# Altium schematic sheet AIRZAI_BASE_BD_REVC Sheet2.SchDoc
size C
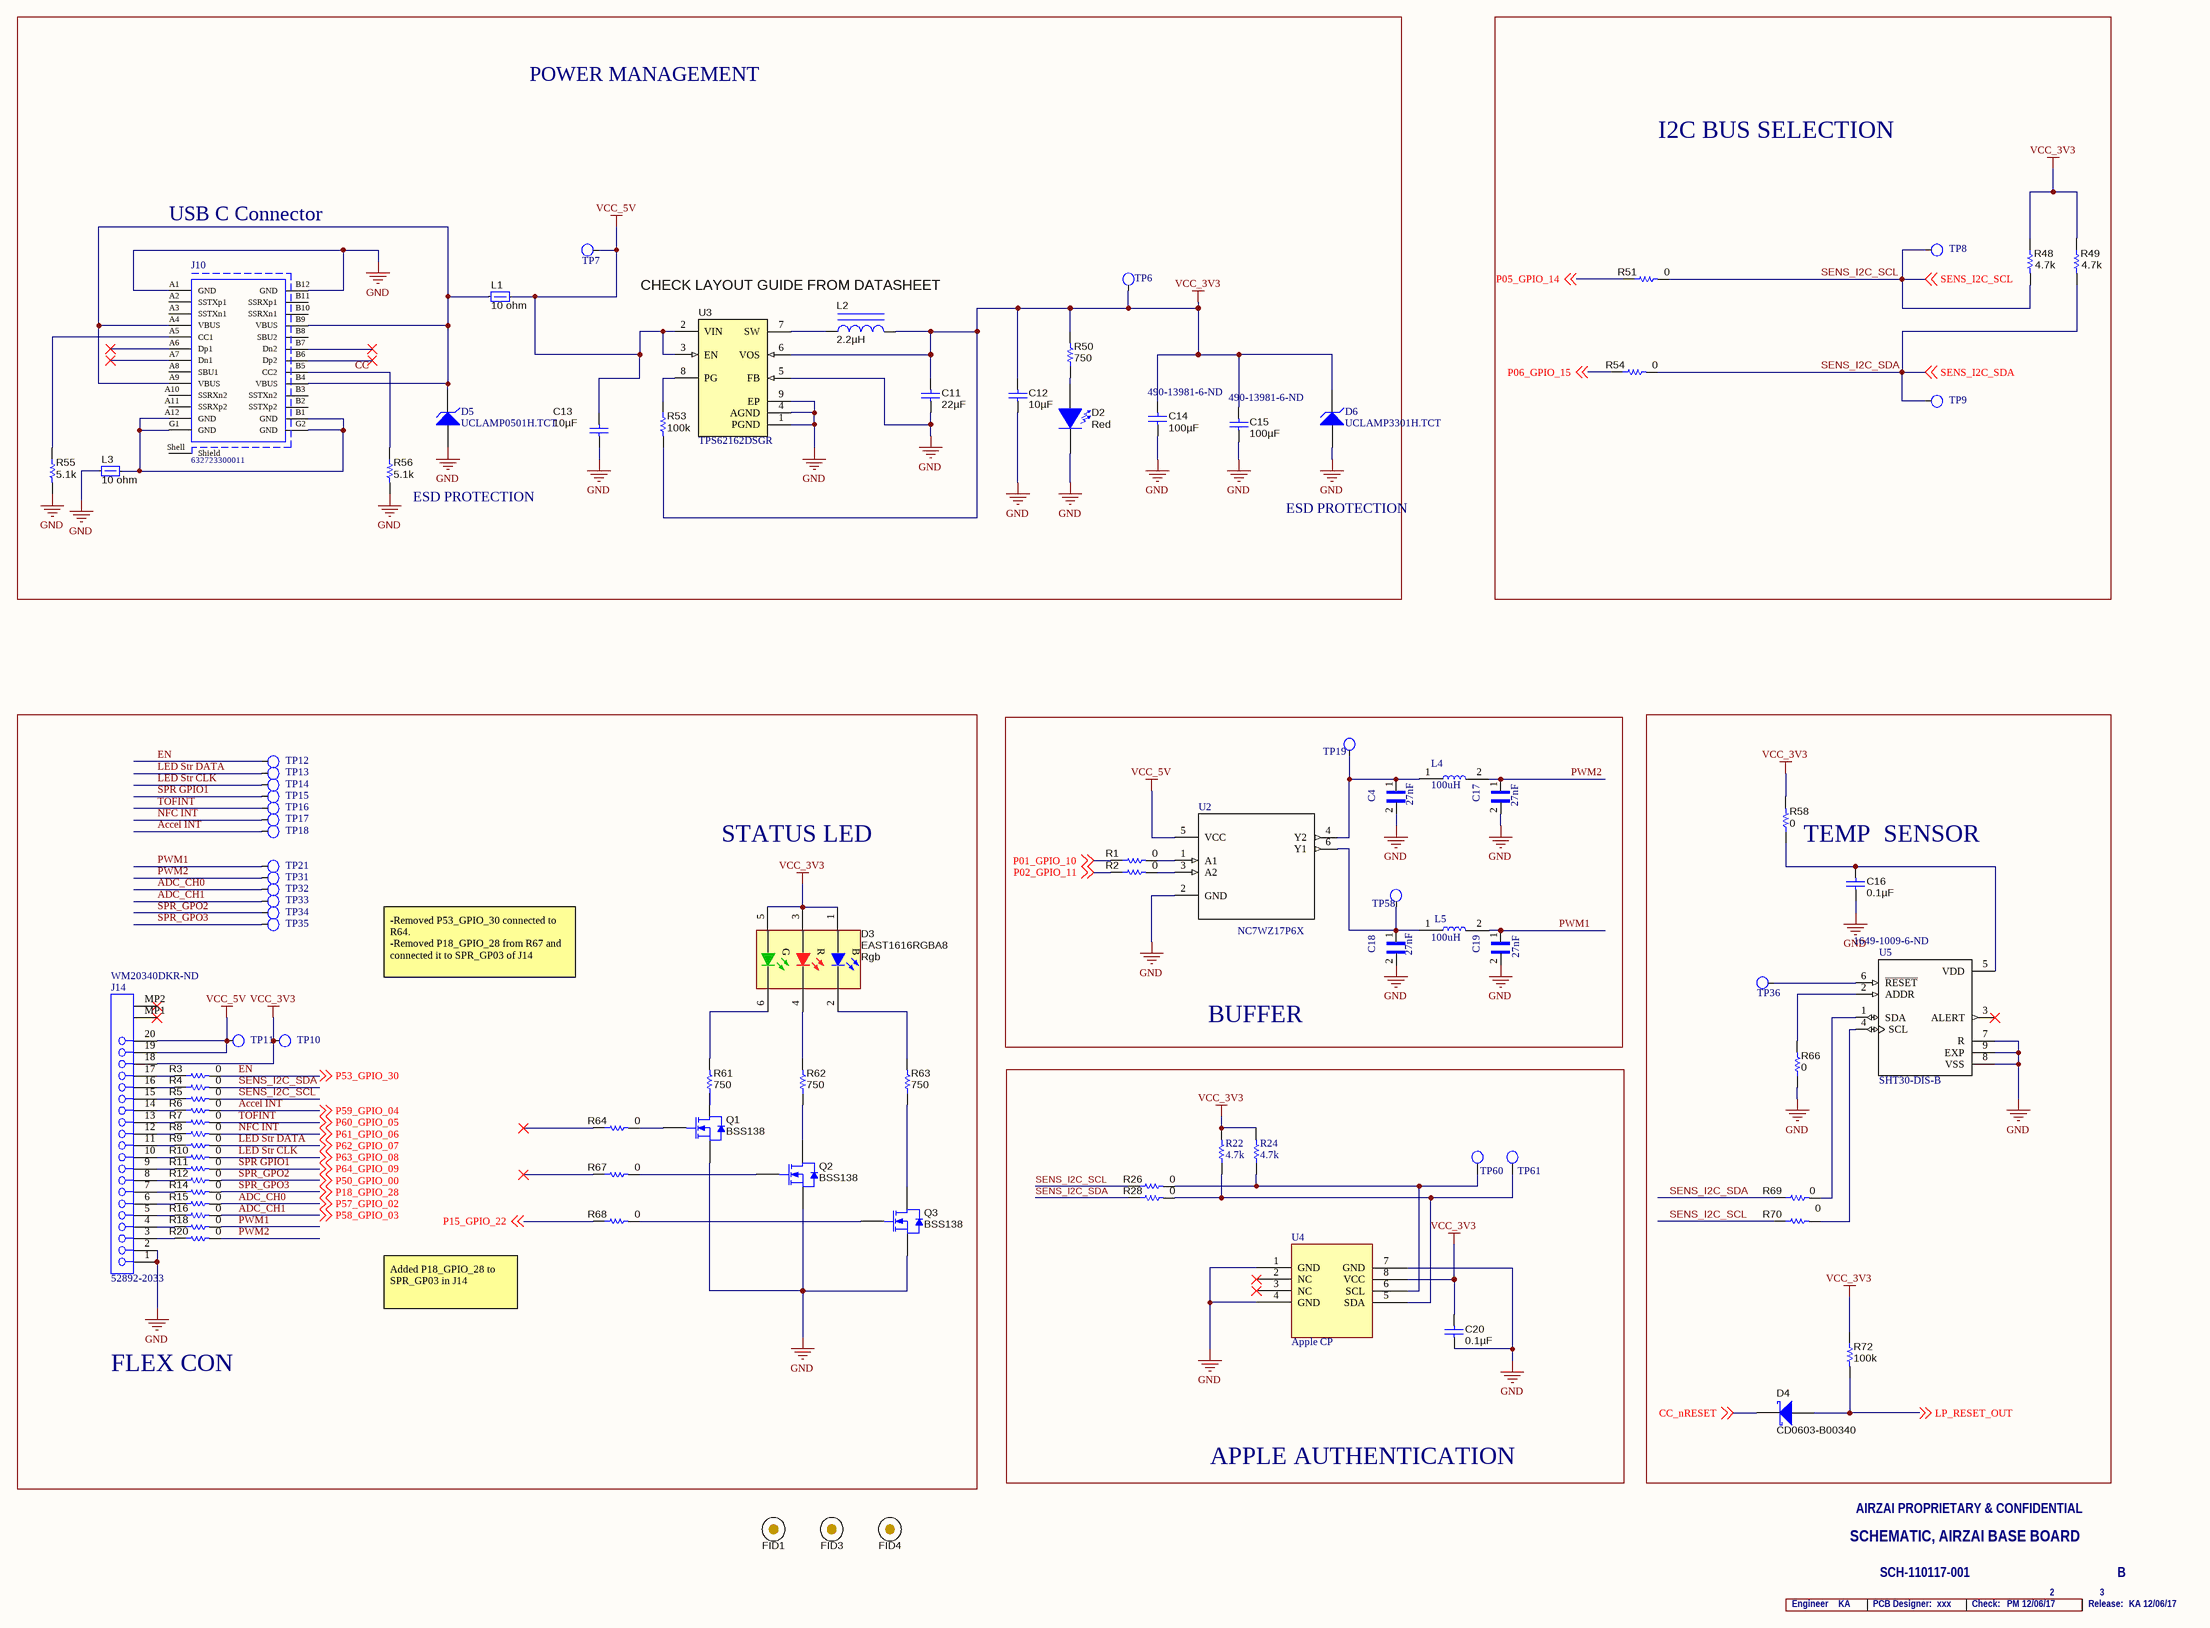
[diagram p0: AIRZAI_BASE_BD_REVC Sheet2.SchDoc]

## Parts
C4  value 27nF  [1206CAP]  (hidden comment: GRM3195C1H273JA01D)
C11  ValueDisplayed: 22µF  [0805_HV]  (hidden comment: C2012X5R1C226K125AC)
C12  ValueDisplayed: 10µF  [0805_HV]  (hidden comment: GRM21BR61A106KE19L)
C13  ValueDisplayed: 10µF  [0805_HV]  (hidden comment: GRM21BR61A106KE19L)
C14  ValueDisplayed: 100µF  Supplier Part Number 3: 490-13981-6-ND  [1206_180]  (hidden comment: GRM31CR60J107ME39L)
C15  ValueDisplayed: 100µF  Supplier Part Number 3: 490-13981-6-ND  [1206_180]  (hidden comment: GRM31CR60J107ME39L)
C16  ValueDisplayed: 0.1µF  [0402]  (hidden comment: GRM155R61A104KA01D)
C17  value 27nF  [1206CAP]  (hidden comment: GRM3195C1H273JA01D)
C18  value 27nF  [1206CAP]  (hidden comment: GRM3195C1H273JA01D)
C19  value 27nF  [1206CAP]  (hidden comment: GRM3195C1H273JA01D)
C20  ValueDisplayed: 0.1µF  [SM0402_BTD.1SM_ACT_H55_CAP_WSS]  (hidden comment: C1005X5R1A104K050BA)
D2  value Red  [SML-31_Red]  (hidden comment: SML-311UTT86)
D3  EAST1616RGBA8  value Rgb  [EAST1616_RGB]
D4  CD0603-B00340  [Diode_0603]
D5  UCLAMP0501H.TCT  [SOD-523]
D6  UCLAMP3301H.TCT  [SOD-523]
FID1  Fiducial  [Fiducial10-20]  (value not drawn)
FID3  Fiducial  [Fiducial10-20]  (value not drawn)
FID4  Fiducial  [Fiducial10-20]  (value not drawn)
J10  632723300011  [632723300011]
J14  52892-2033  Supplier Part Number 1: WM20340DKR-ND  [MOLX-52892-2033]
L1  value 10 ohm  [0402]  (hidden comment: BLM15AG100SN1D)
L2  ValueDisplayed: 2.2µH  [0805_HV]  (hidden comment: BRC2012T2R2MD)
L3  value 10 ohm  [0402]  (hidden comment: BLM15AG100SN1D)
L4  value 100uH  [0805_Inductor]  (hidden comment: MLF2012C101KTD25)
L5  value 100uH  [0805_Inductor]  (hidden comment: MLF2012C101KTD25)
Q1  BSS138  [SOT-23]
Q2  BSS138  [SOT-23]
Q3  BSS138  [SOT-23]
R1  ValueDisplayed: 0  [0402]  (hidden comment: ERJ-2GE0R00X)
R2  ValueDisplayed: 0  [0402]  (hidden comment: ERJ-2GE0R00X)
R3  ValueDisplayed: 0  [0402]  (hidden comment: ERJ-2GE0R00X)
R4  ValueDisplayed: 0  [0402]  (hidden comment: ERJ-2GE0R00X)
R5  ValueDisplayed: 0  [0402]  (hidden comment: ERJ-2GE0R00X)
R6  ValueDisplayed: 0  [0402]  (hidden comment: ERJ-2GE0R00X)
R7  ValueDisplayed: 0  [0402]  (hidden comment: ERJ-2GE0R00X)
R8  ValueDisplayed: 0  [0402]  (hidden comment: ERJ-2GE0R00X)
R9  ValueDisplayed: 0  [0402]  (hidden comment: ERJ-2GE0R00X)
R10  ValueDisplayed: 0  [0402]  (hidden comment: ERJ-2GE0R00X)
R11  ValueDisplayed: 0  [0402]  (hidden comment: ERJ-2GE0R00X)
R12  ValueDisplayed: 0  [0402]  (hidden comment: ERJ-2GE0R00X)
R14  ValueDisplayed: 0  [0402]  (hidden comment: ERJ-2GE0R00X)
R15  ValueDisplayed: 0  [0402]  (hidden comment: ERJ-2GE0R00X)
R16  ValueDisplayed: 0  [0402]  (hidden comment: ERJ-2GE0R00X)
R18  ValueDisplayed: 0  [0402]  (hidden comment: ERJ-2GE0R00X)
R20  ValueDisplayed: 0  [0402]  (hidden comment: ERJ-2GE0R00X)
R22  Resistance (Ohms): 4.7k  [0402]  (hidden comment: RMCF0402JT4K70)
R24  Resistance (Ohms): 4.7k  [0402]  (hidden comment: RMCF0402JT4K70)
R26  ValueDisplayed: 0  [0402]  (hidden comment: ERJ-2GE0R00X)
R28  ValueDisplayed: 0  [0402]  (hidden comment: ERJ-2GE0R00X)
R48  value 4.7k  [0402]
R49  value 4.7k  [0402]
R50  ValueDisplayed: 750  [0603]  (hidden comment: RC0603JR-07750RL)
R51  ValueDisplayed: 0  [0402]  (hidden comment: ERJ-2GE0R00X)
R53  ValueDisplayed: 100k  [0402]  (hidden comment: CRCW0402100KJNED)
R54  ValueDisplayed: 0  [0402]  (hidden comment: ERJ-2GE0R00X)
R55  ValueDisplayed: 5.1k  [0402]  (hidden comment: CRCW040210K0JNED)
R56  ValueDisplayed: 5.1k  [0402]  (hidden comment: CRCW040210K0JNED)
R58  ValueDisplayed: 0  [0402]  (hidden comment: ERJ-2GE0R00X)
R61  ValueDisplayed: 750  [0603]  (hidden comment: RC0603JR-07750RL)
R62  ValueDisplayed: 750  [0603]  (hidden comment: RC0603JR-07750RL)
R63  ValueDisplayed: 750  [0603]  (hidden comment: RC0603JR-07750RL)
R64  ValueDisplayed: 0  [0402]  (hidden comment: ERJ-2GE0R00X)
R66  ValueDisplayed: 0  [0402]  (hidden comment: ERJ-2GE0R00X)
R67  ValueDisplayed: 0  [0402]  (hidden comment: ERJ-2GE0R00X)
R68  ValueDisplayed: 0  [0402]  (hidden comment: ERJ-2GE0R00X)
R69  ValueDisplayed: 0  [0402]  (hidden comment: ERJ-2GE0R00X)
R70  ValueDisplayed: 0  [0402]  (hidden comment: ERJ-2GE0R00X)
R72  ValueDisplayed: 100k  [0402]  (hidden comment: CRCW0402100KJNED)
TP6  WIREPT  [TP_0.9MM]  (value not drawn)
TP7  WIREPT  [TP_0.9MM]  (value not drawn)
TP8  WIREPT  [TP_0.9MM]  (value not drawn)
TP9  WIREPT  [TP_0.9MM]  (value not drawn)
TP10  WIREPT  [TP_0.9MM]  (value not drawn)
TP11  WIREPT  [TP_0.9MM]  (value not drawn)
TP12  WIREPT  [TP_0.9MM]  (value not drawn)
TP13  WIREPT  [TP_0.9MM]  (value not drawn)
TP14  WIREPT  [TP_0.9MM]  (value not drawn)
TP15  WIREPT  [TP_0.9MM]  (value not drawn)
TP16  WIREPT  [TP_0.9MM]  (value not drawn)
TP17  WIREPT  [TP_0.9MM]  (value not drawn)
TP18  WIREPT  [TP_0.9MM]  (value not drawn)
TP19  WIREPT  [TP_0.9MM]  (value not drawn)
TP21  WIREPT  [TP_0.9MM]  (value not drawn)
TP31  WIREPT  [TP_0.9MM]  (value not drawn)
TP32  WIREPT  [TP_0.9MM]  (value not drawn)
TP33  WIREPT  [TP_0.9MM]  (value not drawn)
TP34  WIREPT  [TP_0.9MM]  (value not drawn)
TP35  WIREPT  [TP_0.9MM]  (value not drawn)
TP36  WIREPT  [TP_0.9MM]  (value not drawn)
TP58  WIREPT  [TP_0.9MM]  (value not drawn)
TP60  TESTPOINT  [TP_0.9MM]  (value not drawn)
TP61  TESTPOINT  [TP_0.9MM]  (value not drawn)
U2  NC7WZ17P6X  [SC-70-NC7WZ17P6X]
U3  TPS62162DSGR  [DSG0008A]
U4  Apple CP  [XDFN-8P-Apple]
U5  SHT30-DIS-B  Supplier Part Number 1: 1649-1009-6-ND  [DFN250X250X100-9N]

## Blocks framed on the sheet
I2C BUS SELECTION: R48 R49 R51 R54 TP8 TP9
BUFFER: C4 C17-C19 L4 L5 R1 R2 TP19 TP58 U2
TEMP  SENSOR: C16 D4 R58 R66 R69 R70 R72 TP36 U5
APPLE AUTHENTICATION: C20 R22 R24 R26 R28 TP60 TP61 U4

## Nets
GND: C4.2 C11.2 C12.2 C13.2 C14.2 C15.2 C16.2 C17.2 C18.2 C19.2 C20.2 D2.1(K) D5.A D6.A J10.A1(GND) J10.B12(GND) J14.1 J14.2 L3.2 Q1.2(S) Q2.2(S) Q3.2(S) R55.2 R56.2 R66.1 U2.2(GND) U3.1(PGND) U3.4(AGND) U3.5(FB) U3.9(EP) U4.1(GND) U4.4(GND) U4.7(GND) U5.7(R) U5.8(VSS) U5.9(EXP)
VCC_3V3: C11.1 C12.1 C14.1 C15.1 C20.1 D3.1(A) D3.3(A) D3.5(A) D6.K J14.18 L2.2 R22.2 R24.2 R48.1 R49.1 R50.2 R53.2 R58.2 R72.1 TP6.1 TP10.1 U3.6(VOS) U4.8(VCC)
VCC_5V: C13.1 J14.19 J14.20 L1.2 TP7.1 TP11.1 U2.5(VCC) U3.2(VIN) U3.3(EN)
Accel INT: R6.2 TP18.1 ; off-sheet P59_GPIO_04  [also labelled P59_GPIO_04]
ADC_CH0: R15.2 TP32.1 ; off-sheet P57_GPIO_02  [also labelled P57_GPIO_02]
ADC_CH1: R16.2 TP33.1 ; off-sheet P58_GPIO_03  [also labelled P58_GPIO_03]
CC: J10.B5(CC2) R56.1
CC_nRESET: D4.1(K) ; off-sheet CC_nRESET
EN: R3.2 TP12.1 ; off-sheet P53_GPIO_30  [also labelled P53_GPIO_30]
LED Str CLK: R10.2 TP14.1 ; off-sheet P63_GPIO_08  [also labelled P63_GPIO_08]
LED Str DATA: R9.2 TP13.1 ; off-sheet P62_GPIO_07  [also labelled P62_GPIO_07]
LP_RESET_OUT: D4.2(A) R72.2 ; off-sheet LP_RESET_OUT
NFC INT: R8.2 TP17.1 ; off-sheet P61_GPIO_06  [also labelled P61_GPIO_06]
P01_GPIO_10: R1.1 ; off-sheet P01_GPIO_10
P02_GPIO_11: R2.1 ; off-sheet P02_GPIO_11
P05_GPIO_14: R51.1 ; off-sheet P05_GPIO_14
P06_GPIO_15: R54.1 ; off-sheet P06_GPIO_15
P15_GPIO_22: R68.1 ; off-sheet P15_GPIO_22
PWM1: C19.1 L5.2 R18.2 TP21.1
PWM2: C17.1 L4.2 R20.2 TP31.1
SENS_I2C_SCL: R5.2 R26.1 R48.2 R51.2 R70.1 TP8.1 ; off-sheet SENS_I2C_SCL
SENS_I2C_SDA: R4.2 R28.1 R49.2 R54.2 R69.1 TP9.1 ; off-sheet SENS_I2C_SDA
SPR GPIO1: R11.2 TP15.1 ; off-sheet P64_GPIO_09  [also labelled P64_GPIO_09]
SPR_GPO2: R12.2 TP34.1 ; off-sheet P50_GPIO_00  [also labelled P50_GPIO_00]
SPR_GPO3: R14.2 TP35.1 ; off-sheet P18_GPIO_28  [also labelled P18_GPIO_28]
TOFINT: R7.2 TP16.1 ; off-sheet P60_GPIO_05  [also labelled P60_GPIO_05]
NetC4_1: C4.1 L4.1 TP19.1 U2.4(Y2)
NetC16_1: C16.1 R58.1 U5.5(VDD)
NetC18_1: C18.1 L5.1 TP58.1 U2.6(Y1)
NetD2_2: D2.2(A) R50.1
NetD3_2: D3.2(K) R63.2
NetD3_4: D3.4(K) R62.2
NetD3_6: D3.6(K) R61.2
NetD5_K: D5.K J10.A4(VBUS) J10.A9(VBUS) J10.B4(VBUS) J10.B9(VBUS) L1.1
NetJ10_A5: J10.A5(CC1) R55.1
NetJ10_A12: J10.A12(GND) J10.B1(GND) J10.G1(GND) J10.G2(GND) L3.1
NetJ14_3: J14.3 R20.1
NetJ14_4: J14.4 R18.1
NetJ14_5: J14.5 R16.1
NetJ14_6: J14.6 R15.1
NetJ14_7: J14.7 R14.1
NetJ14_8: J14.8 R12.1
NetJ14_9: J14.9 R11.1
NetJ14_10: J14.10 R10.1
NetJ14_11: J14.11 R9.1
NetJ14_12: J14.12 R8.1
NetJ14_13: J14.13 R7.1
NetJ14_14: J14.14 R6.1
NetJ14_15: J14.15 R5.1
NetJ14_16: J14.16 R4.1
NetJ14_17: J14.17 R3.1
NetL2_1: L2.1 U3.7(SW)
NetQ1_1: Q1.1(G) R64.2
NetQ1_3: Q1.3(D) R61.1
NetQ2_1: Q2.1(G) R67.2
NetQ2_3: Q2.3(D) R62.1
NetQ3_1: Q3.1(G) R68.2
NetQ3_3: Q3.3(D) R63.1
NetR1_2: R1.2 U2.1(A1)
NetR2_2: R2.2 U2.3(A2)
NetR22_1: R22.1 R28.2 TP61.1 U4.5(SDA)
NetR24_1: R24.1 R26.2 TP60.1 U4.6(SCL)
NetR53_1: R53.1 U3.8(PG)
NetR66_2: R66.2 U5.2(ADDR)
NetR69_2: R69.2 U5.1(SDA)
NetR70_2: R70.2 U5.4(SCL)
NetTP36_1: TP36.1 U5.6(~{RESET})

Not connected (* = marked no-connect by the designer): J10 A2(SSTXp1) A3(SSTXn1) A6(Dp1)* A7(Dn1)* A8(SBU1) A10(SSRXn2) A11(SSRXp2) B2(SSTXp2) B3(SSTXn2) B6(Dp2)* B7(Dn2)* B8(SBU2) B10(SSRXn1) B11(SSRXp1) Shell(Shield); J14 MP1* MP2*; R64 1*; R67 1*; U4 2(NC)* 3(NC)*; U5 3(ALERT)*

## Notes on the sheet
- POWER MANAGEMENT
- USB C Connector
- CHECK LAYOUT GUIDE FROM DATASHEET
- (near R56) ESD PROTECTION
- ESD PROTECTION
- STATUS LED
- -Removed P53_GPIO_30 connected to R64.
  -Removed P18_GPIO_28 from R67 and
  connected it to SPR_GP03 of J14
- Added P18_GPIO_28 to SPR_GP03 in J14
- FLEX CON
- SCHEMATIC, AIRZAI BASE BOARD
- AIRZAI PROPRIETARY & CONFIDENTIAL
- Engineer
- KA
- PCB Designer:
- SCH-110117-001
- xxx
- Check:
- PM 12/06/17
- 2
- Release:
- 3
- B
- KA 12/06/17
- Title
- Size:
- Date:
- Number:
- Time:
- Revision:
- Sheet
- of
- File:
- (in symbol EAST1616RGBA8) G; R; B

## Library data of the parts
C4 C17-C19 = GRM3195C1H273JA01D: 1206 27 nF 50 V Â±5% Tolerance C0G SMT Multilayer Ceramic Capacitor; MF: Murata Electronics; Availability: Unavailable; SnapEDA_Link: https://www.snapeda.com/parts/GRM3195C1H273JA01D/Murata%20Electronics%20North%20America/view-part/?ref=snap; Package: 1206 Murata; MP: GRM3195C1H273JA01D; Price: None
C11 = C2012X5R1C226K125AC: CAP, CERM, 22 µF, 16 V, +/- 10%, X5R, 0805; Manufacturer: TDK; Polarized: N; CompType: Capacitor; Value: 22uF; U/M: EA; Cap_F: 0.000022; Tolerance_%: 10; Value1: Unknown; VDC_V: 16; Value2: 16V; TaMin_C: -55; TaMax_C: 85; Cap_Case: 0805; AEC Category: Q200; SizeArea_mm2: 2.5; SizeAreaWB_mm2: 6.75; SizeX_mm: 2; SizeY_mm: 1.25; SizeZ_mm: 1.45; SymbolVersion: 2008-07-09; PartNumber: C2012X5R1C226K125AC; PackageReference: 0805; RoHS: Y; MountType: SMT; Technology: Ceramic; TempCo: X5R; Published: 2008-06-19; Publisher: Texas Instruments; LatestRevisionDate: 2016-07-02; ComponentLink1Description: Datasheet link; ComponentLink1URL: http://product.tdk.com/capacitor/mlcc/en/documents/C2012X5R1C226K125AC.pdf; Supplier 1: Digi-Key; Supplier Part Number 1: 445-6797-1-ND; Supplier 2: Mouser; Supplier Part Number 2: 810-C2012X5R1C226K; Supplier 3: Farnell; Supplier Part Number 3: 2346925; AEC Qualified: ?
C12 C13 = GRM21BR61A106KE19L: CAP, CERM, 10 µF, 10 V, +/- 10%, X5R, 0805; Manufacturer: MuRata; Polarized: N; CompType: Capacitor; Value: 10uF; U/M: EA; Cap_F: 0.00001; Tolerance_%: 10; ESR_ohm: 0.002; Value1: 0.002 ohm; Value2: 10V; TaMin_C: -55; TaMax_C: 85; Cap_Case: 0805; SizeArea_mm2: 2.5; SizeAreaWB_mm2: 6.75; SizeX_mm: 2; SizeY_mm: 1.25; SizeZ_mm: 1.45; AEC Category: Q200; SymbolVersion: 2008-07-09; PartNumber: GRM21BR61A106KE19L; PackageReference: 0805; RoHS: Y; VDC_V: 10; MountType: SMT; Technology: Ceramic; TempCo: X5R; Published: 2008-06-19; Publisher: Texas Instruments; LatestRevisionDate: 2016-07-02; ComponentLink1Description: Datasheet link; ComponentLink1URL: http://search.murata.co.jp/Ceramy/PnsearchViewAction.do?HnOFG=ON&HnNFG=ON&SEL_CNT=50&sLang=en&sKey=GRM21BR61A106KE19L&x=9&y=9&search=startwith; Supplier 1: Digi-Key; Supplier Part Number 1: 490-1709-1-ND; Supplier 2: Mouser; Supplier Part Number 2: 81-GRM21BR61A106KE19; Supplier 3: Farnell; Supplier Part Number 3: 1828805; AEC Qualified: ?
C14 C15 = GRM31CR60J107ME39L: CAP, CERM, 100 µF, 6.3 V, +/- 20%, X5R, 1206; Manufacturer: MuRata; Polarized: N; CompType: Capacitor; Value: 100uF; U/M: EA; Cap_F: 0.0001; Tolerance_%: 20; ESR_ohm: 0.003; Value1: 0.003 ohm; VDC_V: 6.3; Value2: 6.3V; TaMin_C: -55; TaMax_C: 85; Cap_Case: 1206; SizeArea_mm2: 5.12; SizeAreaWB_mm2: 10.92; SizeX_mm: 3.2; SizeY_mm: 1.6; SizeZ_mm: 1.8; AEC Category: Q200; SymbolVersion: 2008-07-09; PartNumber: GRM31CR60J107ME39L; PackageReference: 1206; RoHS: Y; MountType: SMT; Technology: Ceramic; TempCo: X5R; Published: 2008-06-19; Publisher: Texas Instruments; LatestRevisionDate: 2016-07-02; ComponentLink1Description: Datasheet link; ComponentLink1URL: http://search.murata.co.jp/Ceramy/PnsearchViewAction.do?HnOFG=ON&HnNFG=ON&SEL_CNT=50&sLang=en&sKey=GRM31CR60J107ME39L&x=9&y=9&search=startwith; Supplier 1: Mouser; Supplier Part Number 1: 81-GRM31CR60J107ME9L; Supplier 2: Farnell; Supplier Part Number 2: 1735535; AEC Qualified: ?; Supplier 3: Digi-Key
C16 = GRM155R61A104KA01D: CAP, CERM, 0.1 µF, 10 V, +/- 10%, X5R, 0402; Manufacturer: MuRata; Polarized: N; CompType: Capacitor; Value: 0.1uF; U/M: EA; Cap_F: 0.0000001; Tolerance_%: 10; Value1: Unknown; Value2: 10V; TaMin_C: -55; TaMax_C: 85; SizeArea_mm2: 0.5; SizeAreaWB_mm2: 3; SizeX_mm: 1; SizeZ_mm: 0.6; AEC Category: Q200; SymbolVersion: 2008-07-09; PartNumber: GRM155R61A104KA01D; PackageReference: 0402; RoHS: Y; VDC_V: 10; MountType: SMT; Technology: Ceramic; TempCo: X5R; Cap_Case: 0402; SizeY_mm: 0.5; Published: 2008-06-19; Publisher: Texas Instruments; LatestRevisionDate: 2016-08-14; ComponentLink1Description: Datasheet link; ComponentLink1URL: http://search.murata.co.jp/Ceramy/PnsearchViewAction.do?HnOFG=ON&HnNFG=ON&SEL_CNT=50&sLang=en&sKey=GRM155R61A104KA01D&x=9&y=9&search=startwith; Supplier 1: Digi-Key; Supplier Part Number 1: 490-1318-1-ND; Supplier 2: Mouser; Supplier Part Number 2: 81-GRM155R61A104KA01; Supplier 3: Farnell; Supplier Part Number 3: 1828862; AEC Qualified: ?
C20 = C1005X5R1A104K050BA: CAP, CERM, 0.1 µF, 10 V, +/- 10%, X5R, 0402; Manufacturer: TDK; Polarized: N; CompType: Capacitor; Value: 0.1uF; U/M: EA; Cap_F: 0.0000001; Tolerance_%: 10; Value1: Unknown; Value2: 10V; TaMin_C: -55; TaMax_C: 85; Cap_Case: SM0402_BTD.1SM_ACT; SymbolVersion: 2008-07-09; PartNumber: C1005X5R1A104K050BA; PackageReference: 0402; RoHS: Y; VDC_V: 10; MountType: SMT; Technology: Ceramic; TempCo: X5R; Published: 2008-06-19; Publisher: Texas Instruments; LatestRevisionDate: 2015-02-23; ComponentLink1Description: Datasheet link; ComponentLink1URL: http://product.tdk.com/en/catalog/datasheets/mlcc_commercial_general_en.pdf; Supplier 1: Digi-Key; Supplier Part Number 1: 445-1265-1-ND; Supplier 2: Mouser; Supplier Part Number 2: 810-C1005X5R1A104K; Supplier 3: Farnell; Supplier Part Number 3: 2368215
D2 = SML-311UTT86: LED, Red, SMD; Manufacturer: Rohm; Type: AlInGaP; Vf_V: 1.8; Value2: 1.8V; Io_A: 0.002; Value1: W; U/M: EA; CompType: LED; PartNumber: SML-311UTT86; SymbolVersion: 2008-11-06; MountType: SMT; RoHS: Y; PackageReference: LED, 1.6x.8x.8mm; Color: red; Published: 2008-07-11; Publisher: Texas Instruments; ComponentLink1URL: http://rohmfs.rohm.com/en/products/databook/datasheet/opto/led/chip_mono/sml-31.pdf; ComponentLink1Description: Datasheet link; LatestRevisionDate: 2016-06-29; Supplier 1: Digi-Key; Supplier Part Number 1: 511-1304-1-ND; Supplier 2: Mouser; Supplier Part Number 2: 755-SML-311UTT86; Supplier 3: Farnell; Supplier Part Number 3: 1685068
D3 = EAST1616RGBA8: LED, Rgb, SMD; Manufacturer: Everlight; SymbolCreator: Altium; Type: InGaN; Vf_V: 3.7; Value2: 3.7V; Io_A: 0.025; Vr_V: 5; Ir_A: 5e-005; Tjmax_C: 85; Value1: W; Angle: 120; SizeAreaWB_mm2: 6.76; SizeArea_mm2: 2.56; SizeX_mm: 1.6; SizeZ_mm: 0.45; U/M: EA; SymbolVersion: 2016-08-05; PartNumber: EAST1616RGBA8; PackageReference: 1.6x1.6mm; RoHS: Y; CompType: LED; MountType: SMT; Color: RGB; Published: 2008-07-11; Publisher: Texas Instruments; SizeY_mm: 1.6; ComponentLink1URL: https://everlightamericas.com/index.php?controller=attachment&id_attachment=2142; ComponentLink1Description: Datasheet link; LatestRevisionDate: 2016-08-05
D4 = CD0603-B00340: Diode, Schottky, 45 V, 0.03 A, 0603 Diode; Manufacturer: Bourns; U/M: EA; Vf_V: 0.37; Value: 45V; Value1: 0.03A; Value2: 0.37V; Io_A: 0.03; Vr_V: 45; TJmax_C: 125; SizeAreaWB_mm2: 5.13; SizeArea_mm2: 1.53; SizeX_mm: 1.7; SizeY_mm: 0.9; SizeZ_mm: 0.75; AEC Category: Q101; CompType: Diode; SymbolVersion: 2008-12-08; PartNumber: CD0603-B00340; PackageReference: 0603 Diode; MountType: SMT; Type: Schottky; RoHS: Y; Published: 2008-06-26; Publisher: Texas Instruments; LatestRevisionDate: 2016-07-03; ComponentLink1Description: Datasheet link; ComponentLink1URL: http://www.bourns.com/pdfs/SBCD0603_1005.pdf; Supplier 1: Mouser; Supplier Part Number 1: 652-CD0603-B00340; Supplier 2: Farnell; Supplier Part Number 2: 1456534; AEC Qualified: ?
D5 = UCLAMP0501H.TCT: TVS DIODE 5V 12.5V SOD523; Manufacturer: Semtech; Capacitance: 160pF; Number of Channels: 1; Direction: Unidirectional; Reverse Breakdown Voltage: 6V; Peak Pulse Power: 240W; Power Line Protection: No; Leakage Current: 5uA; Peak Pulse Current: 16A; Test Current: 1mA; Element Configuration: Single; ComponentLink1URL: https://www.semtech.com/uploads/documents/uclamp3301h.pdf?src-supplier=Digi-Key; ComponentLink1Description: https://www.semtech.com/uploads/documents/uclamp3301h.pdf?src-supplier=Digi-Key; ComponentLink2URL: https://www.verical.com/server-webapp/html/getDatasheet?partID=141337&src-supplier=Verical; ComponentLink2Description: https://www.verical.com/server-webapp/html/getDatasheet?partID=141337&src-supplier=Verical; ComponentLink3URL: http://www.semtech.com/images/datasheet/uclamp3301h.pdf?src-supplier=Avnet; ComponentLink3Description: http://www.semtech.com/images/datasheet/uclamp3301h.pdf?src-supplier=Avnet; PartNumber: UCLAMP0501H.TCT; Supplier 1: Digi-Key; Manufacturer Part Number: UCLAMP0501H.TCT; Stock 1: 63859; Pricing 1: 1=0.65, 10=0.568, 25=0.5028, 100=0.438, 250=0.38124, 500=0.32446, 1000=0.25956 (USD); Mount: Surface Mount; Number of Pins: 2; Min Operating Temperature: -55°C; Max Operating Temperature: 125°C; Packaging: Tape and Reel; Number of Elements: 1; Number of Unidirectional Channels: 1; Reverse Standoff Voltage: 5V; Min Breakdown Voltage: 6V; Clamping Voltage: 12.5V; Max Breakdown Voltage: 6V; Working Voltage: 5V; Polarity: Unidirectional; Breakdown Voltage: 6V; Max Power Dissipation: 240W; Voltage Rating (DC): 5V; Composition: Zener; Length: 1.3mm; Depth: 0.9mm; Width: 900um; Radiation Hardening: No; REACH SVHC: No SVHC; Lead Free: Lead Free; ComponentLink4URL: http://www.semtech.com/images/datasheet/uclamp0501h.pdf?src-supplier=Future+Electronics; ComponentLink4Description: http://www.semtech.com/images/datasheet/uclamp0501h.pdf?src-supplier=Future+Electronics; ComponentLink5URL: https://www.verical.com/server-webapp/html/getDatasheet?partID=51047&src-supplier=Verical; ComponentLink5Description: https://www.verical.com/server-webapp/html/getDatasheet?partID=51047&src-supplier=Verical; ComponentLink6URL: http://www.semtech.com/images/datasheet/uclamp0501h.pdf?src-supplier=Digi-Key; ComponentLink6Description: http://www.semtech.com/images/datasheet/uclamp0501h.pdf?src-supplier=Digi-Key; ComponentLink7URL: https://www.semtech.com/uploads/documents/uclamp0501h.pdf?src-supplier=Digi-Key; ComponentLink7Description: https://www.semtech.com/uploads/documents/uclamp0501h.pdf?src-supplier=Digi-Key; ComponentLink8URL: http://www.semtech.com/images/datasheet/uclamp0501h.pdf?src-supplier=Element14; ComponentLink8Description: http://www.semtech.com/images/datasheet/uclamp0501h.pdf?src-supplier=Element14; ComponentLink9URL: http://www.farnell.com/datasheets/1796175.pdf?src-supplier=Element14; ComponentLink9Description: http://www.farnell.com/datasheets/1796175.pdf?src-supplier=Element14; ComponentLink10URL: http://www.semtech.com/images/datasheet/uclamp0501h.pdf?src-supplier=Avnet; ComponentLink10Description: http://www.semtech.com/images/datasheet/uclamp0501h.pdf?src-supplier=Avnet; Supplier Part Number 1: UCLAMP0501HDKR-ND
D6 = UCLAMP3301H.TCT: TVS DIODE 3.3V 8V SOD523; Manufacturer: Semtech; Direction: Unidirectional; Capacitance: 30pF; Number of Channels: 1; Min Breakdown Voltage: 3.5V; Peak Pulse Power: 40W; Power Line Protection: No; Leakage Current: 500nA; Peak Pulse Current: 5A; Element Configuration: Single; Supplier 1: Mouser; Manufacturer Part Number: UCLAMP3301H.TCT; Stock 1: 89004; Pricing 1: 1=0.71, 10=0.554, 50=0.554, 100=0.357, 1000=0.286, 10000=0.225 (USD); Mount: Surface Mount; Number of Pins: 2; Min Operating Temperature: -55°C; Max Operating Temperature: 125°C; Packaging: Tape and Reel; Number of Elements: 1; Number of Unidirectional Channels: 1; Reverse Standoff Voltage: 3.3V; Clamping Voltage: 8V; Polarity: Unidirectional; Working Voltage: 3.3V; Max Power Dissipation: 40W; Voltage Rating (DC): 3.3V; Operating Supply Voltage: 3.3V; Composition: Zener; Length: 1.3mm; Depth: 0.9mm; Width: 900um; Thickness: 700um; Radiation Hardening: No; REACH SVHC: No SVHC; Lead Free: Lead Free; ComponentLink1URL: https://www.semtech.com/uploads/documents/uclamp3301h.pdf?src-supplier=Digi-Key; ComponentLink1Description: https://www.semtech.com/uploads/documents/uclamp3301h.pdf?src-supplier=Digi-Key; ComponentLink2URL: https://www.verical.com/server-webapp/html/getDatasheet?partID=141337&src-supplier=Verical; ComponentLink2Description: https://www.verical.com/server-webapp/html/getDatasheet?partID=141337&src-supplier=Verical; ComponentLink3URL: http://www.semtech.com/images/datasheet/uclamp3301h.pdf?src-supplier=Avnet; ComponentLink3Description: http://www.semtech.com/images/datasheet/uclamp3301h.pdf?src-supplier=Avnet; PartNumber: UCLAMP3301H.TCT; Supplier Part Number 1: 947-UCLAMP3301H.TCT
FID1 FID3 FID4 = Fiducial: Fiducial mark.  There is nothing to buy or mount.; SymbolCreator: codlsc; SymbolVersion: 2009-11-4; CompType: Fiducial; Publisher: Texas Instruments; LatestRevisionDate: 2016-05-09; LatestRevisionNote: Added Alternate PartNumber and Alternate Manufacturer parameters to appropriate components.; Manufacturer: N/A; MountType: N/A; PackageReference: N/A; PartNumber: N/A; ClassName: FiducialMark
J10 = 632723300011: USB 3.1 Type C Receptacle WR-COM, Horizontal, SMT / THT; Rated Current: 5 A; Contact Resistance: 30 mOhm; Working Voltage: 20 VDC; ComponentLink1Description: Manufacturer; ComponentLink1URL: http://www.we-online.de; ComponentLink2Description: Datasheet; ComponentLink2URL: https://katalog.we-online.de/em/datasheet/632723x00011%282%29.pdf; Part Number: 632723300011; Published Date: September 2018; Publisher: Wurth Elektronik; Orientation: Horizontal; Connector Type: USB 3.1 Type C; Operating Temperature: -40 to 105 degC; Mounting Technology: SMT / THT; Gender: Receptacle; Packaging: Tape and Reel
J14 = CMP-1241-00473-1: 0.5 mm Pitch Easy-On(TM) Type FPC Connector, 2.0 mm Mated Height, Right Angle, ZIF, SMT, Bottom Contact, 20 Circuits, -40 to 85 degC, ELV and RoHS Compliant, Tape and Reel; Manufacturer: Molex; Material - Metal: Phosphor Bronze; Material - Plating Termination: Silver, Tin-Bismuth; Current (Max per Contact): 0.5A; Pitch - Mating Interface: 0.50mm; PCB Retention: Yes; Mated Height: 2.00mm; Entry Angle: 90degrees Angle; PCB Locator: No; Durability (mating cycles max): 20; Voltage (Max): 50V; ComponentLink1URL: http://www.molex.com/molex/index.jsp; Number of Rows: 1; PartNumber: 52892-2033; Contact Position: Bottom; PackageVersion: Rev. A, 05/2013; ComponentLink2Description: Datasheet; Mounting Technology: Surface Mount; Material - Plating Mating: Silver, Tin-Bismuth; ComponentLink2URL: http://www.molex.com/webdocs/datasheets/pdf/en-us/0528922033_FFC_FPC_CONNECTORS.pdf; PackageDescription: 20-Lead FPC Connector, Pitch 0.5 mm; Packing: Tape and Reel; ComponentLink3Description: Package Specification; ComponentLink3URL: http://www.molex.com/pdm_docs/sd/528922033_sd.pdf; Pitch - Termination Interface: 0.50mm; Orientation: Right Angle; Circuits (Loaded): 20; Polarized to PCB: No; Stackable: No; PackageReference: 52892-2033; ComponentLink1Description: Manufacturer URL; RoHS: TRUE; Supplier 1: Digi-Key
L1 L3 = BLM15AG100SN1D: Ferrite Bead, 10 ohm @ 100 MHz, 1 A, 0402; Manufacturer: MuRata; Imax_A: 1; DCR_ohm: 0.025; Value1: 0.025 ohm; Value2: 1A; ZTyp@100MHz_Ohm: 10; CompType: Ferrite Bead; SymbolVersion: 2009-06-02; PartNumber: BLM15AG100SN1D; MountType: SMT; PackageReference: 0402; Published: 2014-04-30; Publisher: Texas Instruments; LatestRevisionDate: 2016-06-23; ComponentLink1Description: Datasheet link; ComponentLink1URL: http://search.murata.co.jp/Ceramy/image/img/PDF/ENG/L0110S0100BLM15AG_SN.pdf; RoHS: Y; Supplier 1: Digi-Key; Supplier Part Number 1: 490-5176-1-ND; Supplier 2: Mouser; Supplier Part Number 2: 81-BLM15AG100SN1D; Supplier 3: Farnell; Supplier Part Number 3: 1515758
L2 = BRC2012T2R2MD: Inductor, Wirewound, 2.2 µH, 1 A, 0.143 ohm, SMD; Manufacturer: Taiyo Yuden; Value: 2.2uH; Ind_H: 2.2E-6; Imax_A: 1; Irms: 1A @ 40C rise; Isat: 1.1A @ 30% inductance drop; DCR_ohm: 0.143; Value2: 1A; AEC Category: Q200; SymbolVersion: 2008-07-23; CompType: Inductor; PartNumber: BRC2012T2R2MD; Value1: 0.143 ohm; Technology: Wirewound; MountType: SMT; Material: ?; PackageReference: 0805; Published: 2008-06-26; Publisher: Texas Instruments; LatestRevisionDate: 2016-06-28; ComponentLink1Description: Datasheet link; ComponentLink1URL: http://www.yuden.co.jp/ut/product/category/inductor/BRC2012T2R2MD.pdf; RoHS: Y; Supplier 1: Digi-Key; Supplier Part Number 1: 587-2905-1-ND; Supplier 2: Mouser; Supplier Part Number 2: 963-BRC2012T2R2MD; Supplier 3: Farnell; Supplier Part Number 3: 2369453; AEC Qualified: ?
L4 L5 = MLF2012C101KTD25: Fixed Ind 100uh 2ma 3.1 Ohm Smd; MF: TDK; SnapEDA_Link: https://www.snapeda.com/parts/MLF2012C101KTD25/TDK-Lambda%20Americas%20Inc/view-part/?ref=snap; MP: MLF2012C101KTD25; Availability: Unavailable; Price: None; Package: 0805 TDK
Q1-Q3 = BSS138: MOSFET, N-CH, 50 V, 0.22 A, SOT-23; Manufacturer: Fairchild Semiconductor; Alternate Manufacturer: None; U/M: EA; ChType: N; Value: 50V; VdsMax_V: 50; Value1: 6 ohm; Rdson45_ohm: 6; Value2: 1.7 nC; QgTyp_nC: 1.7; Vgs_V: 20; IdsMax_A: 0.22; SizeAreaWB_mm2: 14; SizeArea_mm2: 7.5; SizeX_mm: 2.5; SizeY_mm: 3; SizeZ_mm: 1.1; AEC Category: Q101; SymbolVersion: 2008-07-28; CompType: MOSFET; PartNumber: BSS138; PackageReference: SOT-23; RoHS: Y; MountType: SMT; Published: 2008-06-19; Publisher: Texas Instruments; LatestRevisionDate: 2016-06-29; LatestRevisionNote: Added parts.; ComponentLink1Description: Datasheet link; ComponentLink1URL: http://www.fairchildsemi.com/ds/BS/BSS138.pdf; Supplier 1: Digi-Key; Supplier Part Number 1: BSS138CT-ND; Supplier 2: Mouser; Supplier Part Number 2: 512-BSS138; Supplier 3: Farnell; Supplier Part Number 3: 9845330; AEC Qualified: ?
R1 R2 R26 R28 = ERJ-2GE0R00X: RES, 0, 5%, 0.063 W, 0402; Manufacturer: Panasonic; CompType: Resistor; Value_Code: 0000; Tolerance_%: 5; Power_W: 0.063; Value2: 0.063W; VDC_V: 50; TempCo: 600 ppm/C; EIA_Code: E24; U/M: EA; SizeArea_mm2: 0.5; SizeX_mm: 1; SizeZ_mm: 0.6; AEC Category: Q200; MF: Panasonic Electronic Components; SymbolVersion: 2009-05-29; PartNumber: ERJ-2GE0R00X; PackageReference: 0402; RoHS: Y; Res_ohm: 0; Value1: 5%; MountType: SMT; Technology: Thick Film; Published: 2008-06-26; Publisher: Texas Instruments; LatestRevisionDate: 2016-07-01; ComponentLink1Description: Datasheet link; ComponentLink1URL: http://www.panasonic.com/industrial/components/pdf/AOA0000CE1.pdf; Supplier 1: Digi-Key; Supplier Part Number 1: P0.0JCT-ND; Supplier 2: Mouser; Supplier Part Number 2: 667-ERJ-2GE0R00X; Supplier 3: Farnell; Supplier Part Number 3: 2059190; SizeY_mm: 0.5; AEC Qualified: ?; Digi-Key_Part_Number: P0.0JCT-ND; Digi-Key_Purchase_URL: https://www.digikey.ca/products/en?keywords=P0.0JCT-ND; MP: ERJ-2GE0R00X; Package: 0402 (1005 Metric)
R3-R12 R14-R16 R18 R20 R51 R54 R58 R64 R66-R70 = ERJ-2GE0R00X: RES, 0, 5%, 0.063 W, 0402; Manufacturer: Panasonic; CompType: Resistor; Value: 0; Value_Code: 0000; Tolerance_%: 5; Power_W: 0.063; Value2: 0.063W; VDC_V: 50; TempCo: 600 ppm/C; EIA_Code: E24; U/M: EA; SizeArea_mm2: 0.5; SizeX_mm: 1; SizeZ_mm: 0.6; AEC Category: Q200; SymbolVersion: 2009-05-29; PartNumber: ERJ-2GE0R00X; PackageReference: 0402; RoHS: Y; Res_ohm: 0; Value1: 5%; MountType: SMT; Technology: Thick Film; Published: 2008-06-26; Publisher: Texas Instruments; LatestRevisionDate: 2016-07-01; ComponentLink1Description: Datasheet link; ComponentLink1URL: http://www.panasonic.com/industrial/components/pdf/AOA0000CE1.pdf; Supplier 1: Digi-Key; Supplier Part Number 1: P0.0JCT-ND; Supplier 2: Mouser; Supplier Part Number 2: 667-ERJ-2GE0R00X; Supplier 3: Farnell; Supplier Part Number 3: 2059190; SizeY_mm: 0.5; AEC Qualified: ?
R22 R24 = RES-2: Chip Resistor, 4.7 KOhm, +/- 5%, 0.063 W, -55 to 155 degC, 0402 (1005 Metric), RoHS, Tape and Reel; Manufacturer: Stackpole-Electronics-Inc.; Temperature Coefficient: ±100ppm/°C; Power (Watts): 0.063W,1/16W; Tolerance: ±5%; Family: ChipResistor-SurfaceMount; Datasheet Version: 01/2017; Composition: ThickFilm; Operating Temperature: -55°C~155°C; Features: AutomotiveAEC-Q200; Package Reference: 0402; Datasheet URL: https://www.seielect.com/Catalog/SEI-RMCF_RMCP.pdf; Package Description: 2-Pin Surface Mount Device, Body 1 x 0.5 mm; Packaging: Digi-Reel®; Package / Case: 0402(1005Metric); Category: Resistors; Mounting Technology: SurfaceMount; Number of Terminations: 2; Supplier Device Package: 0402; Manufacturer URL: https://www.seielect.com/; Series: RMCF; Supplier 1: Digi-Key; Supplier Part Number 1: RMCF0402JT4K70-ND; Manufacturer Part.No: RMCF0402JT4K70
R48 R49 = CRCW04023K30JNED: RES SMD 4.7K OHM 1% 1/16W 0402; Manufacturer: Yageo; Manufacturer Part Number: RC0402FR-074K7L; Voltage Rating (DC): 50V; Power Rating: 62.5mW; Resistance: 4.7kR; Temperature Coefficient: 100ppm/°C; ComponentLink1Description: Datasheet link; ComponentLink1URL: http://www.vishay.com/docs/20035/dcrcwe3.pdf; Supplier 1: Digi-Key; Supplier Part Number 1: 311-4.7KLRDKR-ND; Stock 1: 27955304; Pricing 1: 1=0.1, 10=0.016, 100=0.0067, 1000=0.00301, 2500=0.00261, 5000=0.00215 (USD); Case/Package: 0402; Number of Pins: 2; Case Code (Imperial): 0402; Case Code (Metric): 1005; Min Operating Temperature: -55°C; Max Operating Temperature: 155°C; Tolerance: 1%; Packaging: Tape and Reel; Voltage Rating: 50V; Composition: Thick Film; Termination: SMD/SMT; Military Standard: Not; Length: 1mm; Height: 0.32mm; Depth: 0.5mm; Width: 0.5mm; REACH SVHC: No SVHC; Lead Free: Lead Free; ComponentLink2URL: http://documents.rs-components.com/techlib://itc_doclist_GB.htm?stockno=6184558&src-supplier=RSComponents; ComponentLink2Description: http://documents.rs-components.com/techlib://itc_doclist_GB.htm?stockno=6184558&src-supplier=RSComponents; ComponentLink3URL: http://www.farnell.com/datasheets/1018594.pdf?src-supplier=Element14; ComponentLink3Description: http://www.farnell.com/datasheets/1018594.pdf?src-supplier=Element14; ComponentLink4URL: https://www.verical.com/server-webapp/html/getDatasheet?partID=328119&src-supplier=Verical; ComponentLink4Description: https://www.verical.com/server-webapp/html/getDatasheet?partID=328119&src-supplier=Verical; ComponentLink5URL: http://www.farnell.com/datasheets/1686128.pdf?src-supplier=Element14; ComponentLink5Description: http://www.farnell.com/datasheets/1686128.pdf?src-supplier=Element14
R50 R61-R63 = RC0603JR-07750RL: RES, 750, 5%, 0.1 W, 0603; Manufacturer: Yageo America; CompType: Resistor; Value: 750; Value_Code: 750R; Tolerance_%: 5; Power_W: 0.1; Value2: 0.1W; VDC_V: 50; TempCo: 100 ppm/C; SizeArea_mm2: 1.28; SizeX_mm: 1.6; SizeY_mm: 0.8; SizeZ_mm: 1; EIA_Code: E24; U/M: EA; AEC Category: Q200; SymbolVersion: 2009-05-29; PartNumber: RC0603JR-07750RL; PackageReference: 0603; RoHS: Y; Res_ohm: 750; Value1: 5%; MountType: SMT; Technology: Thick Film; Published: 2008-06-26; Publisher: Texas Instruments; LatestRevisionDate: 2016-11-02; ComponentLink1Description: Datasheet link; ComponentLink1URL: http://www.yageo.com/pdf/Pu-RC0603_51_PbFree_L_2.pdf; Supplier 1: Digi-Key; Supplier Part Number 1: 311-750GRCT-ND; Supplier 2: Mouser; Supplier Part Number 2: 603-RC0603JR-07750RL; Supplier 3: Farnell; Supplier Part Number 3: 1799450; AEC Qualified: ?
R53 R72 = CRCW0402100KJNED: RES, 100 k, 5%, 0.063 W, 0402; Manufacturer: Vishay-Dale; CompType: Resistor; Value: 100k; Res_ohm: 100000; Tolerance_%: 5; Power_W: 0.063; Value2: 0.063W; VDC_V: 50; TempCo: 200 ppm/C; EIA_Code: E24; U/M: EA; SizeArea_mm2: 0.5; SizeX_mm: 1; SizeZ_mm: 0.6; AEC Category: Q200; SymbolVersion: 2009-05-29; PartNumber: CRCW0402100KJNED; PackageReference: 0402; RoHS: Y; Value_Code: 100k; Value1: 5%; MountType: SMT; Technology: Thick Film; Published: 2008-06-26; Publisher: Texas Instruments; LatestRevisionDate: 2016-07-01; ComponentLink1Description: Datasheet link; ComponentLink1URL: http://www.vishay.com/docs/20035/dcrcwe3.pdf; Supplier 1: Digi-Key; Supplier Part Number 1: 541-100KJCT-ND; Supplier 2: Mouser; Supplier Part Number 2: 71-CRCW0402J-100K-E3; Supplier 3: Farnell; Supplier Part Number 3: 1652738; SizeY_mm: 0.5; AEC Qualified: ?
R55 R56 = CRCW040210K0JNED: RES, 10 k, 5%, 0.063 W, 0402; Manufacturer: Vishay-Dale; CompType: Resistor; Value: 10k; Res_ohm: 10000; Value_Code: 10k0; Tolerance_%: 5; Power_W: 0.063; Value2: 0.063W; VDC_V: 50; TempCo: 200 ppm/C; EIA_Code: E24; U/M: EA; SizeArea_mm2: 0.5; SizeX_mm: 1; SizeZ_mm: 0.6; AEC Category: Q200; SymbolVersion: 2009-05-29; PartNumber: CRCW040210K0JNED; PackageReference: 0402; RoHS: Y; Value1: 5%; MountType: SMT; Technology: Thick Film; Published: 2008-06-26; Publisher: Texas Instruments; LatestRevisionDate: 2016-07-01; ComponentLink1Description: Datasheet link; ComponentLink1URL: http://www.vishay.com/docs/20035/dcrcwe3.pdf; Supplier 1: Digi-Key; Supplier Part Number 1: 541-10KJCT-ND; Supplier 2: Mouser; Supplier Part Number 2: 71-CRCW0402J-10K-E3; Supplier 3: Farnell; Supplier Part Number 3: 1514663; SizeY_mm: 0.5; AEC Qualified: ?
U2 = NC7WZ17P6X: NC7WZ17 Series 5.5 V TinyLogic UHS Dual Buffer w/ Schmitt Trigger Inputs-SC-70-6; MF: ON Semiconductor; Package: SC-70-6 ON Semiconductor; MP: NC7WZ17P6X; Price: None; Availability: Unavailable; SnapEDA_Link: https://www.snapeda.com/parts/NC7WZ17P6X/ON%20Semiconductor/view-part/?ref=snap; Value: *
U3 = TPS62162DSGR: Buck Step Down Regulator with 3 to 17 V Input and 3.3 V Output, -40 to 85 degC, 8-Pin WSON (DSG), Green (RoHS & no Sb/Br); Manufacturer: Texas Instruments; Alternate PartNumber: Equivalent; Duty Cycle(Max)(%): 100; Iout(Max)(A): 1; Iq(Typ)(mA): 0.017; Preset Vout(V): 3.3; Rating: Catalog; SubFamily: Step-Down Regulator; Switch Current Limit(Typ)(A): 1.8; Synchronous Rectification: TRUE; Vin(Max)(V): 17; Vin(Min)(V): 3; DatasheetVersion: SLVSAM2A; PackageVersion: revB, Oct-2010; PackageReference: DSG0008A; PackageDescription: 8-Pin Plastic Small Outline No-Lead, 2 x 2 x 0.8 mm Body, 0.5 mm Pitch, Exposed Pad; Supplier 1: Digi-Key; Supplier Part Number 1: TPS62162DSGR-ND; Supplier 2: Newark; Supplier Part Number 2: 74T5557; Supplier 3: Mouser; Supplier Part Number 3: 595-TPS62162DSGR; Eco-Plan: Green (RoHS & no Sb/Br); Regulated Outputs(#): 1; Topology: Buck; Vout(Max)(V): 3.3; Vout(Min)(V): 3.3; MountType: SMT; PartNumber: TPS62162DSGR; Code_JEDEC: MO-229; ComponentLink1Description: Datasheet; ComponentLink1URL: http://www.ti.com/general/docs/lit/getliterature.tsp?genericPartNumber=TPS62162&fileType=pdf; ComponentLink2Description: URL Link1; ComponentLink2URL: Samples URL:http://www.ti.com/product/tps62162#samples; Alternate Manufacturer: Texas Instruments
U4 = Apple CP: Auth 3.0 CP; MP: MFI343S00177; MF: Apple; Package: 8-XDFN; Supplier: Avnet; Supplier P.No: *; Value: *
U5 = SHT30-DIS-B: SHT3x Series 5.5 V Â±3 %RH 0 to 100% Temperature and Humidity Sensor - DFN-8; MF: Sensirion AG; Availability: Unavailable; MP: SHT30-DIS-B; SnapEDA_Link: https://www.snapeda.com/parts/SHT30-DIS-B/Sensirion%20AG/view-part/?ref=snap; Price: None; Package: DFN-8 Sensirion; Value: *; Supplier 1: Digi-Key